# Altium schematic sheet MAXIM-ADC1.SchDoc
size B
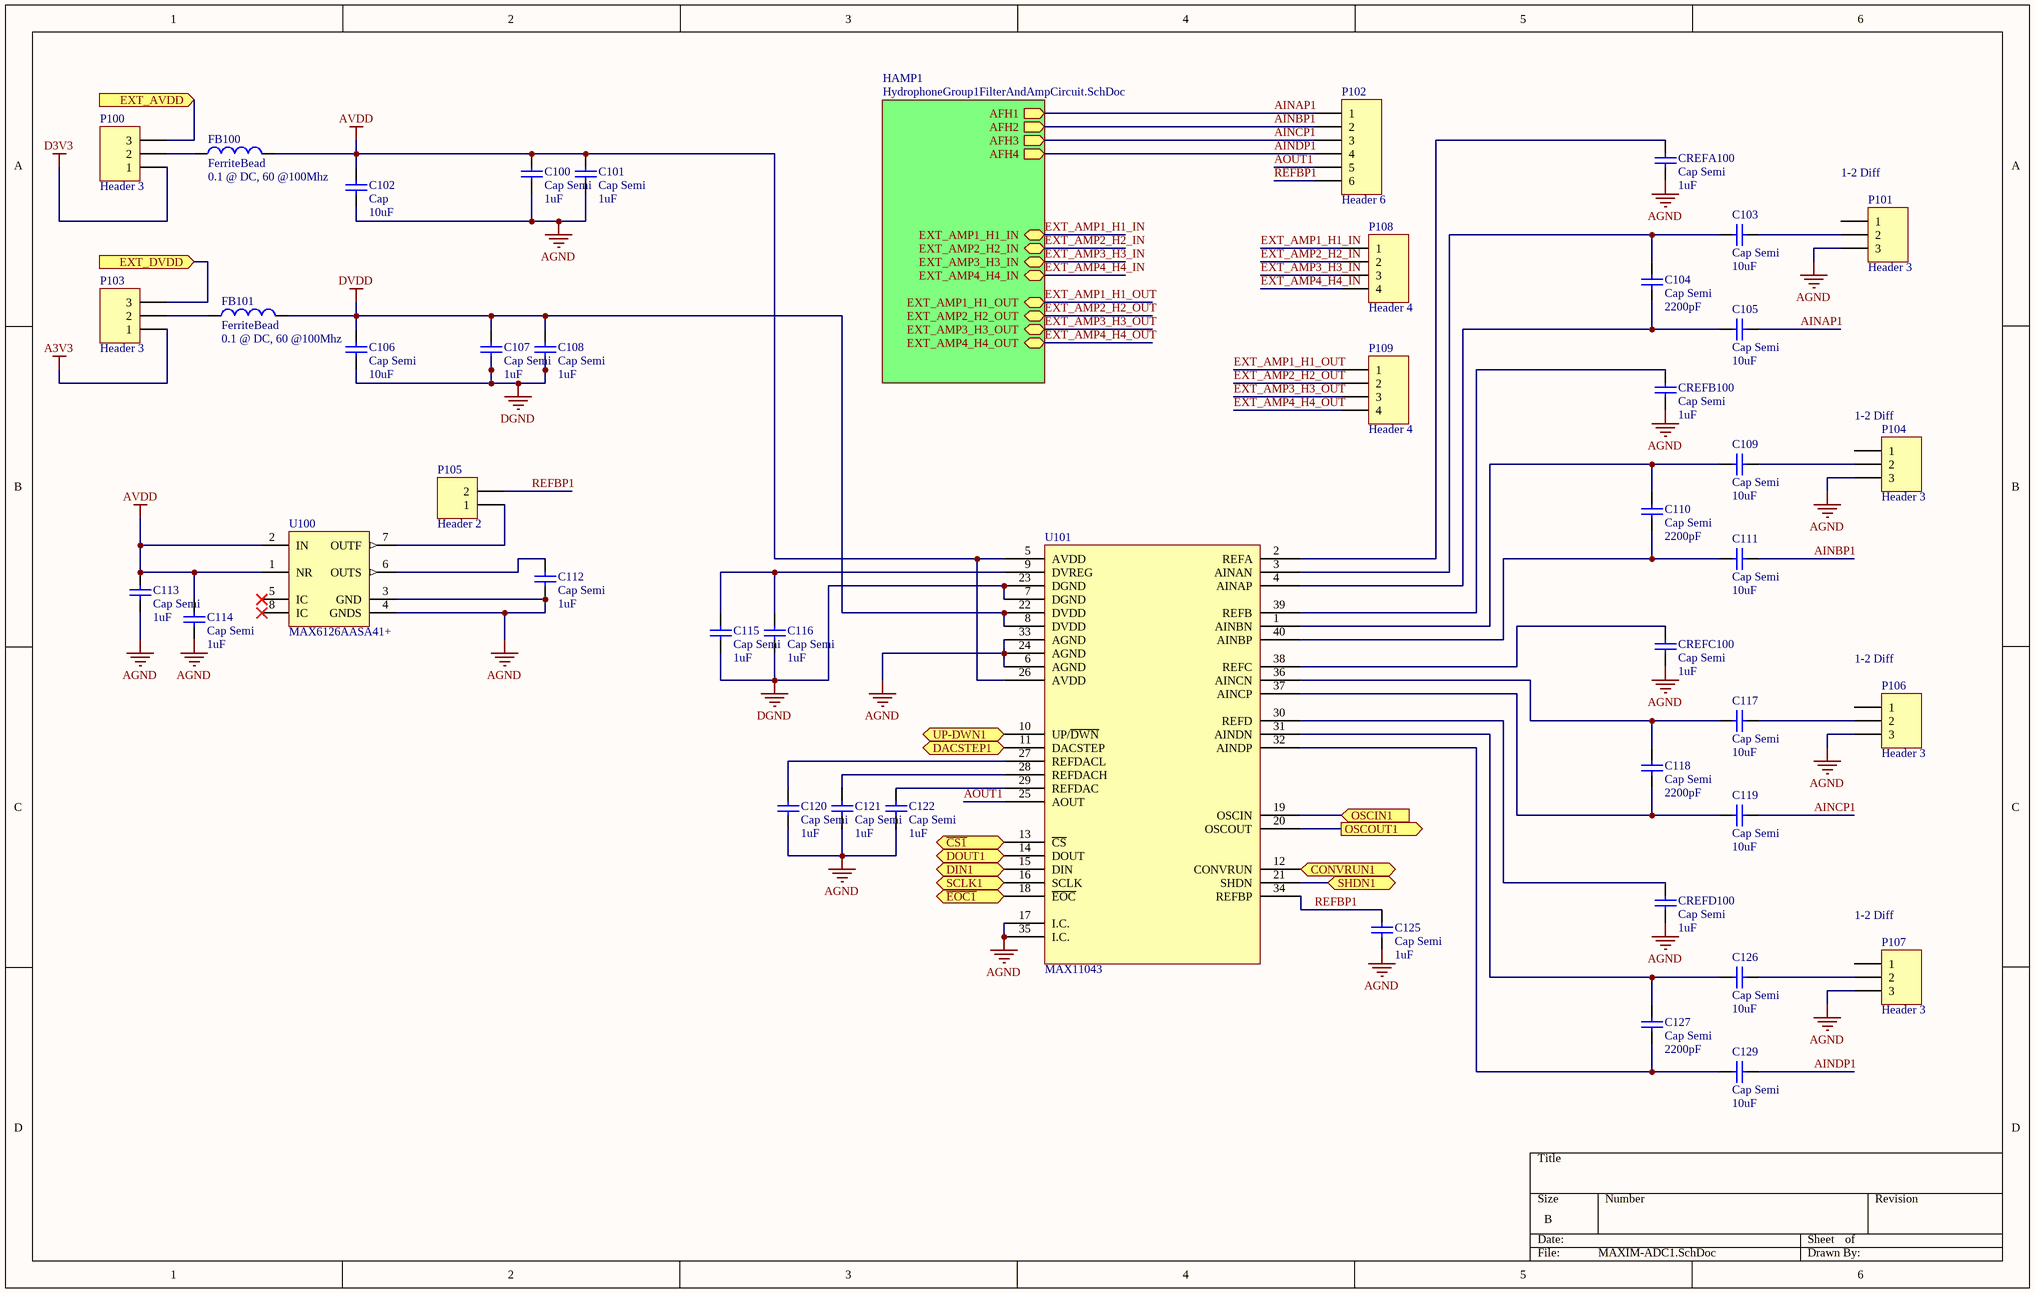
[diagram p0: MAXIM-ADC1.SchDoc]

## Parts
C100  Cap Semi  value 1uF  [1608[0603]]
C101  Cap Semi  value 1uF  [1608[0603]]
C102  Cap  value 10uF  [1608[0603]]
C103  Cap Semi  value 10uF  [1608[0603]]
C104  Cap Semi  value 2200pF  [1608[0603]]
C105  Cap Semi  value 10uF  [1608[0603]]
C106  Cap Semi  value 10uF  [C1206]
C107  Cap Semi  value 1uF  [1608[0603]]
C108  Cap Semi  value 1uF  [C1206]
C109  Cap Semi  value 10uF  [1608[0603]]
C110  Cap Semi  value 2200pF  [1608[0603]]
C111  Cap Semi  value 10uF  [1608[0603]]
C112  Cap Semi  value 1uF  [1608[0603]]
C113  Cap Semi  value 1uF  [1608[0603]]
C114  Cap Semi  value 1uF  [1608[0603]]
C115  Cap Semi  value 1uF  [1608[0603]]
C116  Cap Semi  value 1uF  [1608[0603]]
C117  Cap Semi  value 10uF  [1608[0603]]
C118  Cap Semi  value 2200pF  [1608[0603]]
C119  Cap Semi  value 10uF  [1608[0603]]
C120  Cap Semi  value 1uF  [1608[0603]]
C121  Cap Semi  value 1uF  [1608[0603]]
C122  Cap Semi  value 1uF  [1608[0603]]
C125  Cap Semi  value 1uF  [1608[0603]]
C126  Cap Semi  value 10uF  [1608[0603]]
C127  Cap Semi  value 2200pF  [1608[0603]]
C129  Cap Semi  value 10uF  [1608[0603]]
CREFA100  Cap Semi  value 1uF  [1608[0603]]
CREFB100  Cap Semi  value 1uF  [1608[0603]]
CREFC100  Cap Semi  value 1uF  [1608[0603]]
CREFD100  Cap Semi  value 1uF  [1608[0603]]
FB100  FerriteBead  value 0.1 @ DC, 60 @100Mhz  [0603]
FB101  FerriteBead  value 0.1 @ DC, 60 @100Mhz  [0603]
P100  Header 3  [HDR1X3]
P101  Header 3  [HDR1X3]
P102  Header 6  [HDR1X6]
P103  Header 3  [HDR1X3]
P104  Header 3  [HDR1X3]
P105  Header 2  [HDR1X2]
P106  Header 3  [HDR1X3]
P107  Header 3  [HDR1X3]
P108  Header 4  [HDR1X4]
P109  Header 4  [HDR1X4]
U100  MAX6126AASA41+  [MAXM-S8+4_L]
U101  MAX11043  [QFN50P600X600X80_HS-41N]

## Sub-sheets
HAMP1 = HydrophoneGroup1FilterAndAmpCircuit.SchDoc: AFH1 (out), AFH2 (out), AFH3 (out), AFH4 (out), EXT_AMP1_H1_IN, EXT_AMP2_H2_IN, EXT_AMP3_H3_IN, EXT_AMP4_H4_IN, EXT_AMP1_H1_OUT, EXT_AMP2_H2_OUT, EXT_AMP3_H3_OUT, EXT_AMP4_H4_OUT

## Ports
CONVRUN1 (in), DACSTEP1 (in), DIN1 (in), DOUT1 (out), EXT_AVDD (in), EXT_DVDD (in), OSCIN1 (in), OSCOUT1 (out), SCLK1 (in), SHDN1, UP-DWN1 (in), ~{CS1} (in), ~{EOC1} (out)

## Nets
A3V3: P103.1
AGND: C100.2 C101.2 C102.2 C112.2 C113.2 C114.2 C120.1 C121.2 C122.1 C125.2 CREFA100.1 CREFB100.1 CREFC100.1 CREFD100.1 P101.3 P104.3 P106.3 P107.3 U100.3(GND) U100.4(GNDS) U101.6(AGND) U101.17(I.C.) U101.24(AGND) U101.33(AGND) U101.35(I.C.)
AVDD: C100.1 C101.1 C102.1 C113.1 C114.1 FB100.2 U100.1(NR) U100.2(IN) U101.5(AVDD) U101.26(AVDD)
D3V3: P100.1
DGND: C106.2 C107.2 C108.2 C115.2 C116.2 U101.7(DGND) U101.23(DGND)
DVDD: C106.1 C107.1 C108.1 FB101.2 U101.8(DVDD) U101.22(DVDD)
AINAP1: C105.1 P102.1 ; sheet HAMP1/AFH1
AINBP1: C111.1 P102.2 ; sheet HAMP1/AFH2
AINCP1: C119.1 P102.3 ; sheet HAMP1/AFH3
AINDP1: C129.1 P102.4 ; sheet HAMP1/AFH4
AOUT1: P102.5 U101.25(AOUT)
~{CS1}: U101.13(~{CS}) ; port ~{CS1}
CONVRUN1: U101.12(CONVRUN) ; port CONVRUN1
DACSTEP1: U101.11(DACSTEP) ; port DACSTEP1
DIN1: U101.15(DIN) ; port DIN1
DOUT1: U101.14(DOUT) ; port DOUT1
~{EOC1}: U101.18(~{EOC}) ; port ~{EOC1}
EXT_AMP1_H1_IN: P108.1 ; sheet HAMP1/EXT_AMP1_H1_IN
EXT_AMP1_H1_OUT: P109.1 ; sheet HAMP1/EXT_AMP1_H1_OUT
EXT_AMP2_H2_IN: P108.2 ; sheet HAMP1/EXT_AMP2_H2_IN
EXT_AMP2_H2_OUT: P109.2 ; sheet HAMP1/EXT_AMP2_H2_OUT
EXT_AMP3_H3_IN: P108.3 ; sheet HAMP1/EXT_AMP3_H3_IN
EXT_AMP3_H3_OUT: P109.3 ; sheet HAMP1/EXT_AMP3_H3_OUT
EXT_AMP4_H4_IN: P108.4 ; sheet HAMP1/EXT_AMP4_H4_IN
EXT_AMP4_H4_OUT: P109.4 ; sheet HAMP1/EXT_AMP4_H4_OUT
EXT_AVDD: P100.3 ; port EXT_AVDD
EXT_DVDD: P103.3 ; port EXT_DVDD
OSCIN1: U101.19(OSCIN) ; port OSCIN1
OSCOUT1: U101.20(OSCOUT) ; port OSCOUT1
REFBP1: C125.1 P102.6 P105.2 U101.34(REFBP)
SCLK1: U101.16(SCLK) ; port SCLK1
SHDN1: U101.21(SHDN) ; port SHDN1
UP-DWN1: U101.10(UP/~{DWN}) ; port UP-DWN1
NetC103_1: C103.1 P101.2
NetC103_2: C103.2 C104.2 U101.3(AINAN)
NetC104_1: C104.1 C105.2 U101.4(AINAP)
NetC109_1: C109.1 P104.2
NetC109_2: C109.2 C110.2 U101.1(AINBN)
NetC110_1: C110.1 C111.2 U101.40(AINBP)
NetC112_1: C112.1 U100.6(OUTS)
NetC115_1: C115.1 C116.1 U101.9(DVREG)
NetC117_1: C117.1 P106.2
NetC117_2: C117.2 C118.2 U101.36(AINCN)
NetC118_1: C118.1 C119.2 U101.37(AINCP)
NetC120_2: C120.2 U101.27(REFDACL)
NetC121_1: C121.1 U101.28(REFDACH)
NetC122_2: C122.2 U101.29(REFDAC)
NetC126_1: C126.1 P107.2
NetC126_2: C126.2 C127.2 U101.31(AINDN)
NetC127_1: C127.1 C129.2 U101.32(AINDP)
NetCREFA100_2: CREFA100.2 U101.2(REFA)
NetCREFB100_2: CREFB100.2 U101.39(REFB)
NetCREFC100_2: CREFC100.2 U101.38(REFC)
NetCREFD100_2: CREFD100.2 U101.30(REFD)
NetFB100_1: FB100.1 P100.2
NetFB101_1: FB101.1 P103.2
NetP105_1: P105.1 U100.7(OUTF)

Not connected (* = marked no-connect by the designer): P101 1; P104 1; P106 1; P107 1; U100 5(IC)* 8(IC)*

## Notes on the sheet
- (near P101) 1-2 Diff
- (near P104) 1-2 Diff
- (near P106) 1-2 Diff
- (near P107) 1-2 Diff

## Library data of the parts
C100-C122 C125-C127 C129 CREFA100 CREFB100 CREFC100 CREFD100 = Cap Semi: Capacitor (Semiconductor SIM Model); Published: 8-Jun-2000; LatestRevisionDate: 29-May-2009; LatestRevisionNote: IPC-7351 Footprint Added.; PackageReference: C1206; Publisher: Altium Limited; PackageDescription: Chip Capacitor
FB100 FB101 = Inductor: Code_IEC: 1005; Published: 8-Jun-2000; LatestRevisionDate: 29-May-2009; LatestRevisionNote: IPC-7351 Footprint Added.; PackageReference: 0402-A; Publisher: Altium Limited; PackageDescription: Chip Inductor; Code_JEITA: 0402
P100 P101 P103 P104 P106 P107 = Header 3: Header, 3-Pin; LatestRevisionDate: 17-Jul-2002; LatestRevisionNote: Re-released for DXP Platform.; Publisher: Altium Limited
P102 = Header 6: Header, 6-Pin; LatestRevisionDate: 17-Jul-2002; LatestRevisionNote: Re-released for DXP Platform.; Publisher: Altium Limited
P105 = Header 2: Header, 2-Pin; LatestRevisionDate: 17-Jul-2002; LatestRevisionNote: Re-released for DXP Platform.; Publisher: Altium Limited
P108 P109 = Header 4: Header, 4-Pin; LatestRevisionDate: 17-Jul-2002; LatestRevisionNote: Re-released for DXP Platform.; Publisher: Altium Limited
U100 = CMP-0977-00016-1: Ultra-High-Precision, Ultra-Low-Noise, Series Voltage Reference, 4.096 V, -40 to 125 degC, 8-Pin SOIC (S8+4), RoHS, Tube; Manufacturer: Maxim; Output Voltage Accuracy: 0.02% Max.; Line Regulation: 60 uV/V Max.; VOUT: 4.096 V; Dropout Voltage@10 mA: 0.1 V Typ.; VIN: 4.3 to 12.6 V; Operating Temperature: -40 to 125 degC; ComponentLink3URL: http://pdfserv.maximintegrated.com/package_dwgs/21-0041.PDF; PartNumber: MAX6126AASA41+; RoHS: TRUE; ComponentLink3Description: Package Specification; ComponentLink1URL: http://www.maximintegrated.com/; Mounting Technology: Surface Mount; Packing: Tube; DatasheetVersion: Rev. 6; ComponentLink1Description: Manufacturer URL; ComponentLink2URL: http://datasheets.maximintegrated.com/en/ds/MAX6126.pdf; PackageDescription: 8-Pin Small Outline Integrated Circuit Package, Body 4.9 x 3.9 mm, Pitch 1.27 mm; ComponentLink2Description: Datasheet; PackageVersion: Rev. E